# Altium schematic sheet TipWiring.SchDoc
size A
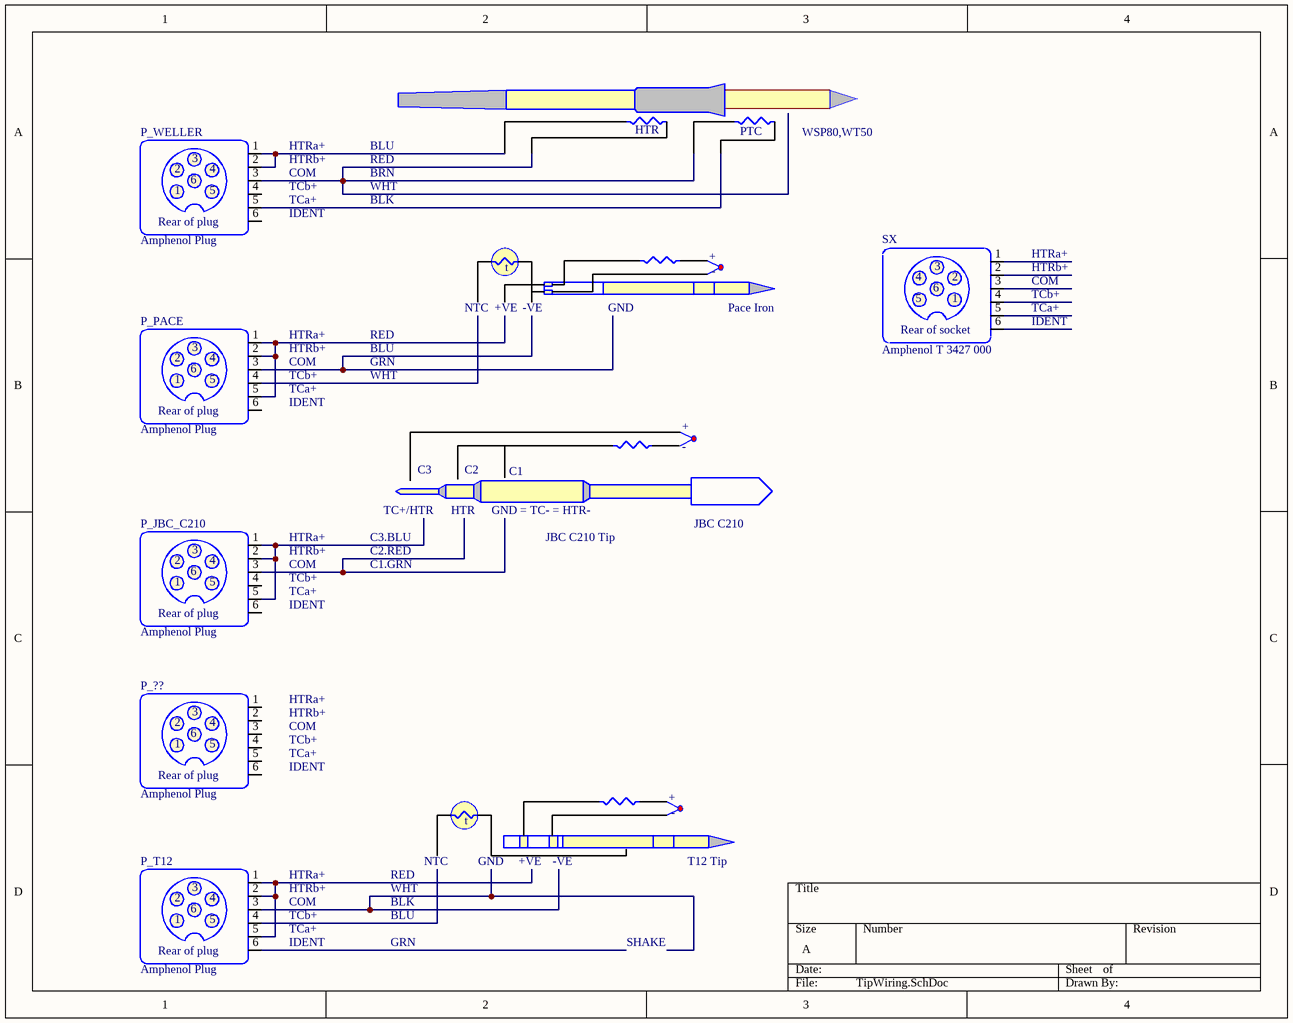
[diagram p0: TipWiring.SchDoc]

## Parts
JBC_C210_Tip  JBC C210  (mechanical)
P_??  Amphenol Plug  (mechanical)
P_JBC_C210  Amphenol Plug  (mechanical)
P_PACE  Amphenol Plug  (mechanical)
P_T12  Amphenol Plug  (mechanical)
P_WELLER  Amphenol Plug  (mechanical)
Pace_Iron  Pace  (value not drawn)  (mechanical)
SX  Amphenol T 3427 000  (mechanical)
T12_Tip  T12 Tip  (value not drawn)  (mechanical)
WSP80,WT50  WELLER WSP80  (value not drawn)  (mechanical)

## Nets
NetP_JBC_C210_1: P_JBC_C210.1 P_JBC_C210.2 P_JBC_C210.5
NetP_PACE_1: P_PACE.1 P_PACE.2 P_PACE.5
NetP_T12_1: P_T12.1 P_T12.2 P_T12.5
NetP_WELLER_1: P_WELLER.1 P_WELLER.2

Not connected (* = marked no-connect by the designer): P_?? 1 2 3 4 5 6; P_JBC_C210 3 4 6; P_PACE 3 4 6; P_T12 3 4 6; P_WELLER 3 4 5 6; SX 1 2 3 4 5 6

## Notes on the sheet
- (near P_WELLER) HTRb+
- (near P_WELLER) HTRa+
- RED
- BLU
- (near P_WELLER) TCa+
- (near P_WELLER) COM
- (near P_WELLER) IDENT
- (near P_WELLER) TCb+
- WHT
- BLK
- BRN
- (near SX) HTRb+
- (near SX) HTRa+
- (near SX) COM
- (near SX) TCb+
- (near P_PACE) HTRb+
- (near P_PACE) HTRa+
- (near P_PACE) COM
- GRN
- (near SX) TCa+
- (near SX) IDENT
- (near P_PACE) TCa+
- (near P_PACE) IDENT
- (near P_PACE) TCb+
- (near P_JBC_C210) HTRb+
- (near P_JBC_C210) HTRa+
- (near P_JBC_C210) COM
- C2.RED
- C1.GRN
- C3.BLU
- (near P_JBC_C210) TCa+
- (near P_JBC_C210) IDENT
- (near P_JBC_C210) TCb+
- (near P_??) HTRa+
- (near P_??) HTRb+
- (near P_??) TCa+
- (near P_??) COM
- (near P_??) IDENT
- (near P_??) TCb+
- (near P_T12) HTRb+
- (near P_T12) HTRa+
- (near P_T12) COM
- (near P_T12) TCa+
- (near P_T12) IDENT
- (near P_T12) TCb+
- SHAKE
- (in symbol Amphenol Plug) Rear of plug
- (in symbol Amphenol T 3427 000) Rear of socket
- (in symbol JBC C210) +; -; C3; C2; C1; TC+/HTR; HTR; GND = TC- = HTR-
- (in symbol Pace) +; t; -; NTC; +VE; -VE; GND
- (in symbol T12 Tip) +; -; t; NTC; GND; +VE; -VE
- (in symbol WELLER WSP80) HTR; PTC

## Library data of the parts
P_?? P_JBC_C210 P_PACE P_T12 P_WELLER = Amphenol Plug: Circular Connector, C091B Series, Panel Mount Receptacle, 6 Contacts, Solder Socket, Metal Body
SX = Amphenol T 3427 000: Circular Connector, C091B Series, Panel Mount Receptacle, 6 Contacts, Solder Socket, Metal Body